# Altium schematic sheet TopLayer.SchDoc
size A
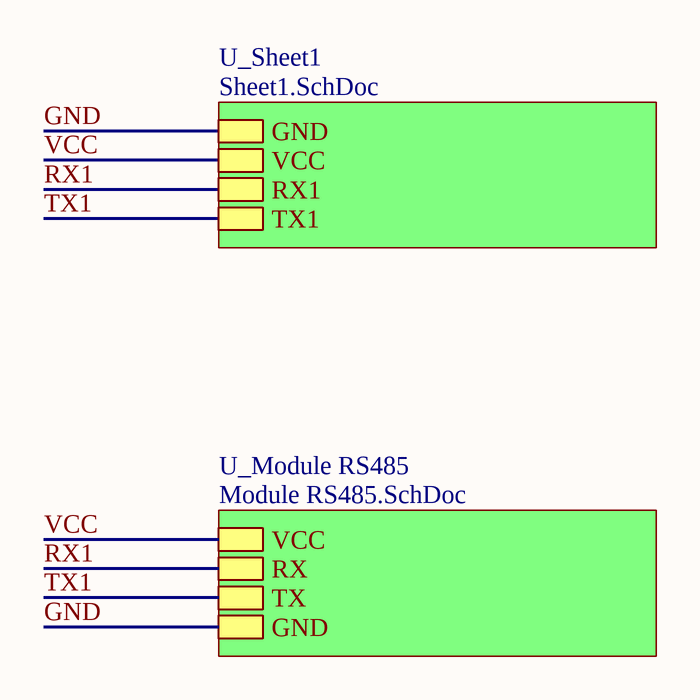
[diagram p0: TopLayer.SchDoc]

## Sub-sheets
U_Module RS485 = Module RS485.SchDoc: VCC, RX, TX, GND
U_Sheet1 = Sheet1.SchDoc: GND, VCC, RX1, TX1

## Nets
GND: sheet U_Module RS485/GND, sheet U_Sheet1/GND
RX1: sheet U_Module RS485/RX, sheet U_Sheet1/RX1
TX1: sheet U_Module RS485/TX, sheet U_Sheet1/TX1
VCC: sheet U_Module RS485/VCC, sheet U_Sheet1/VCC